# Altium schematic sheet Car.SchDoc
size A4
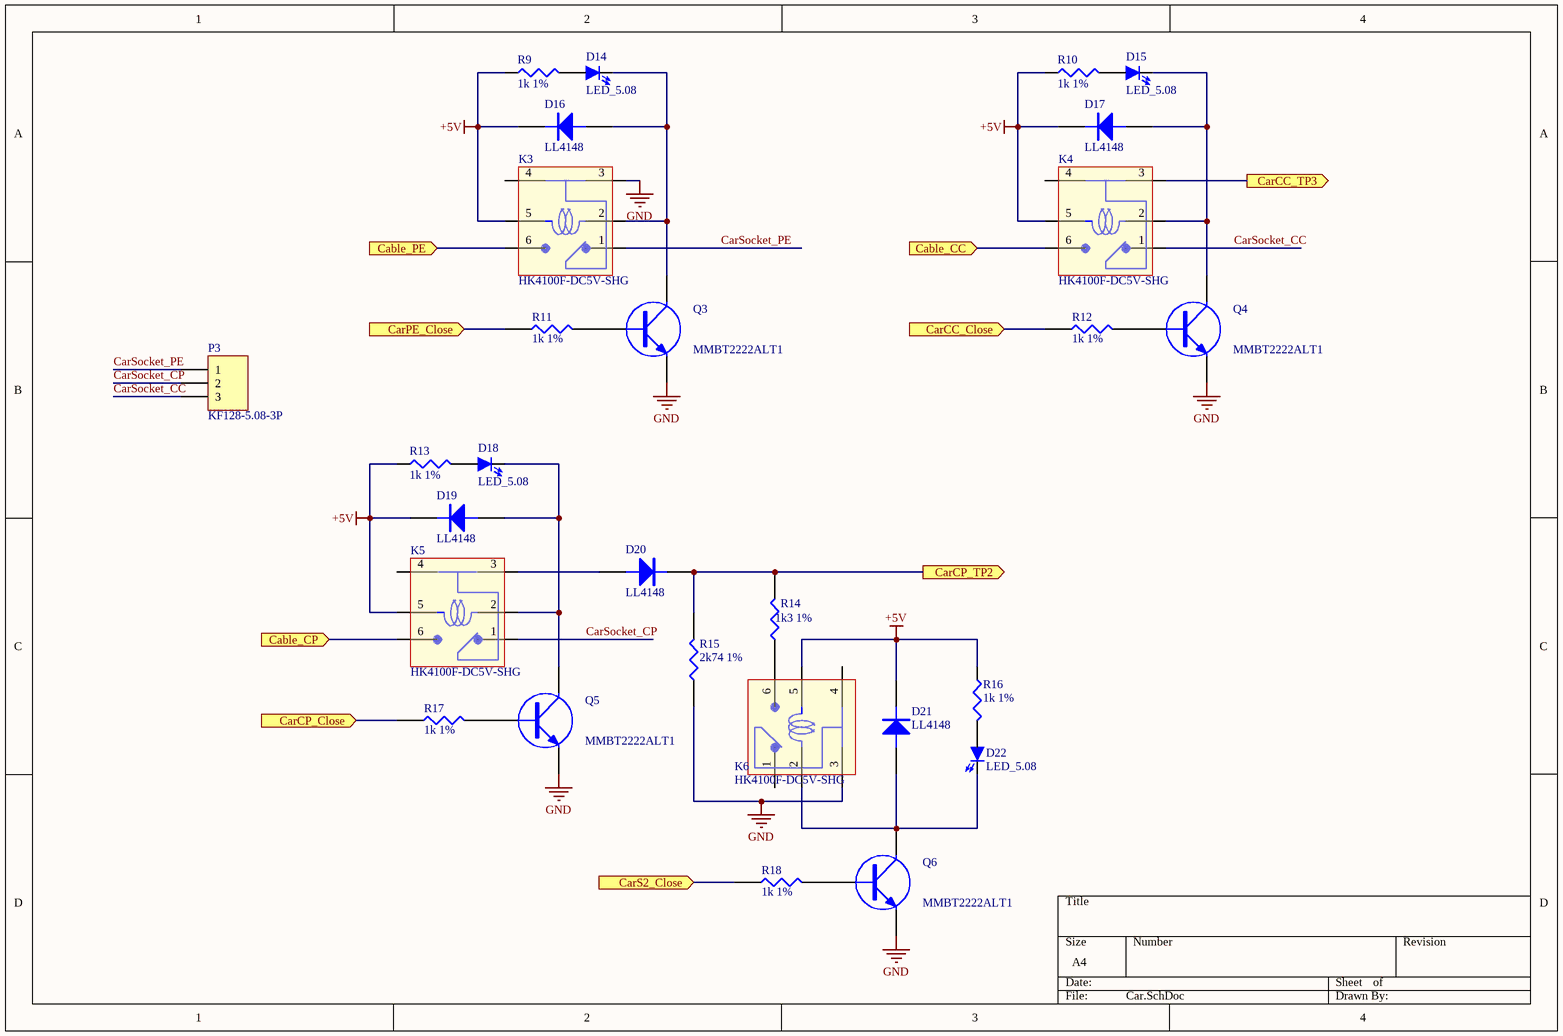
[diagram p0: Car.SchDoc]

## Parts
D14  LED_5.08  [LED5.08/2.54-2]
D15  LED_5.08  [LED5.08/2.54-2]
D16  LL4148  [MELF-D3513-1405]
D17  LL4148  [MELF-D3513-1405]
D18  LED_5.08  [LED5.08/2.54-2]
D19  LL4148  [MELF-D3513-1405]
D20  LL4148  [MELF-D3513-1405]
D21  LL4148  [MELF-D3513-1405]
D22  LED_5.08  [LED5.08/2.54-2]
K3  HK4100F-DC5V-SHG  [HK4100F-DC5V-SHG]
K4  HK4100F-DC5V-SHG  [HK4100F-DC5V-SHG]
K5  HK4100F-DC5V-SHG  [HK4100F-DC5V-SHG]
K6  HK4100F-DC5V-SHG  [HK4100F-DC5V-SHG]
P3  KF128-5.08-3P  [KF128-5.08-3P]
Q3  MMBT2222ALT1  [SOT23-3M]
Q4  MMBT2222ALT1  [SOT23-3M]
Q5  MMBT2222ALT1  [SOT23-3M]
Q6  MMBT2222ALT1  [SOT23-3M]
R9  1k 1%  [RESC2012N]
R10  1k 1%  [RESC2012N]
R11  1k 1%  [RESC2012N]
R12  1k 1%  [RESC2012N]
R13  1k 1%  [RESC2012N]
R14  1k3 1%  [RESC2012N]
R15  2k74 1%  [RESC2012N]
R16  1k 1%  [RESC2012N]
R17  1k 1%  [RESC2012N]
R18  1k 1%  [RESC2012N]

## Ports
Cable_CC (in), Cable_CP (in), Cable_PE (in), CarCC_Close (in), CarCC_TP3 (out), CarCP_Close (in), CarCP_TP2 (out), CarPE_Close (in), CarS2_Close (in)

## Nets
+5V: D16.2(K) D17.2(K) D19.2(K) D21.2(K) K3.5 K4.5 K5.5 K6.5 R9.1 R10.1 R13.1 R16.1
GND: K3.3 K6.3 Q3.2(E) Q4.2(E) Q5.2(E) Q6.2(E) R15.1
Cable_CC: K4.6 ; port Cable_CC
Cable_CP: K5.6 ; port Cable_CP
Cable_PE: K3.6 ; port Cable_PE
CarCC_Close: R12.1 ; port CarCC_Close
CarCC_TP3: K4.3 ; port CarCC_TP3
CarCP_Close: R17.1 ; port CarCP_Close
CarCP_TP2: D20.2(K) R14.2 R15.2 ; port CarCP_TP2
CarPE_Close: R11.1 ; port CarPE_Close
CarS2_Close: R18.1 ; port CarS2_Close
CarSocket_CC: K4.1 P3.3
CarSocket_CP: K5.1 P3.2
CarSocket_PE: K3.1 P3.1
NetD14_1: D14.1(A) R9.2
NetD14_2: D14.2(K) D16.1(A) K3.2 Q3.3(C)
NetD15_1: D15.1(A) R10.2
NetD15_2: D15.2(K) D17.1(A) K4.2 Q4.3(C)
NetD18_1: D18.1(A) R13.2
NetD18_2: D18.2(K) D19.1(A) K5.2 Q5.3(C)
NetD20_1: D20.1(A) K5.3
NetD21_1: D21.1(A) D22.2(K) K6.2 Q6.3(C)
NetD22_1: D22.1(A) R16.2
NetK6_6: K6.6 R14.1
NetQ3_1: Q3.1(B) R11.2
NetQ4_1: Q4.1(B) R12.2
NetQ5_1: Q5.1(B) R17.2
NetQ6_1: Q6.1(B) R18.2

Not connected (* = marked no-connect by the designer): K3 4; K4 4; K5 4; K6 1 4

## Library data of the parts
D14 D15 D18 D22 = LED_5.08: Through hole LED dia.5.08
D16 D17 D19-D21 = DIODE: Price: 0.03
K3-K6 = HK4100F-DC5V-SHG: HUI KE DC5V relay
P3 = Header 3: Car socket connector; LatestRevisionDate: 17-Jul-2002; LatestRevisionNote: Re-released for DXP Platform.; Publisher: Altium Limited
Q3-Q6 = NPN: Price: 0.25
R9 R10 R13 R16 = Res3: Resistor
R11 R12 R14 R15 R17 R18 = RES1